# EAGLE design 2 Motors_V2 (EAGLE 9.6.2)
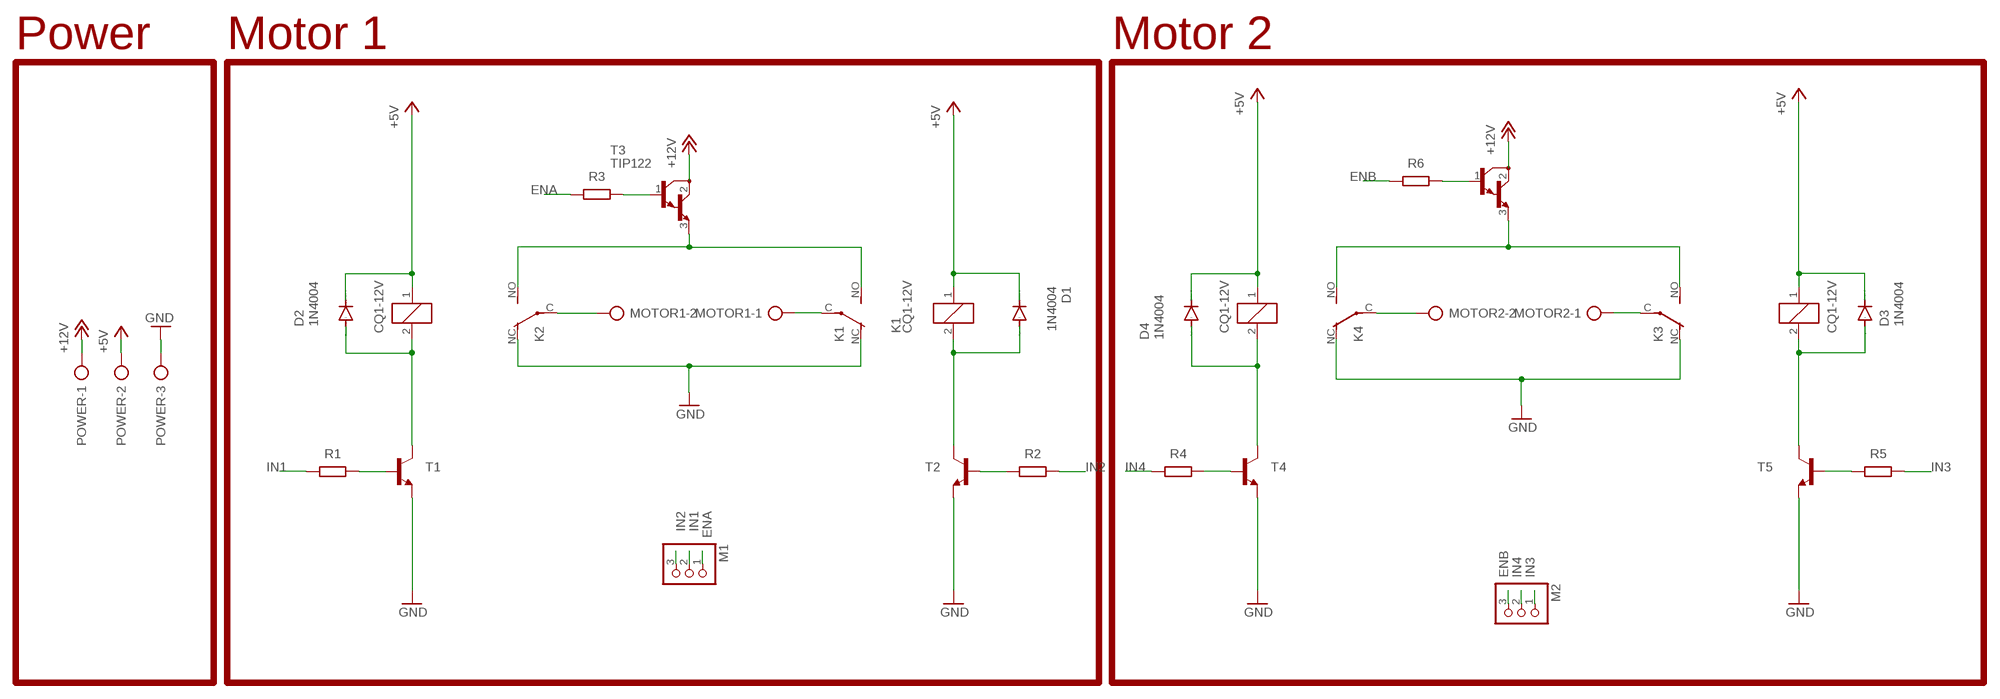
[diagram p0: schematic, sheet 1]

## Parts
D1  1N4004  [DO41-10]
D2  1N4004  [DO41-10]
D3  1N4004  [DO41-10]
D4  1N4004  [DO41-10]
K1  CQ1-12V  [CQ1]
K2  CQ1-12V  [CQ1]
K3  CQ1-12V  [CQ1]
K4  CQ1-12V  [CQ1]
M1  PINHD-1X3  [1X03]
M2  PINHD-1X3  [1X03]
MOTOR1  AK300/2  [AK300/2]
MOTOR2  AK300/2  [AK300/2]
POWER  AK300/3  [AK300/3]
R1  4.7k  R-EU_0204/7  [0204/7]
R2  4.7k  R-EU_0204/7  [0204/7]
R3  4.7k  R-EU_0204/7  [0204/7]
R4  4.7k  R-EU_0204/7  [0204/7]
R5  4.7k  R-EU_0204/7  [0204/7]
R6  4.7k  R-EU_0204/7  [0204/7]
T1  2N2222-NPN-TO92-EBC  [TO92-EBC]
T2  2N2222-NPN-TO92-EBC  [TO92-EBC]
T3  TIP122  [TO220]
T4  2N2222-NPN-TO92-EBC  [TO92-EBC]
T5  2N2222-NPN-TO92-EBC  [TO92-EBC]
T6  TIP122  [TO220]

## Nets
+5V: D1.C D2.C D3.C D4.C K1.1 K2.1 K3.1 K4.1 POWER.2
+12V: POWER.1 T3.2(C) T6.2(C)
ENA: M1.1 R3.2
ENB: M2.3 R6.2
GND: K1.NC(2:O) K2.NC(2:O) K3.NC(2:O) K4.NC(2:O) POWER.3 T1.E T2.E T4.E T5.E
IN1: M1.2 R1.1
IN2: M1.3 R2.1
IN3: M2.1 R5.1
IN4: M2.2 R4.2
N$1: K2.C(2:P) MOTOR1.2
N$2: K1.NO(2:S) K2.NO(2:S) T3.3(E)
N$3: D2.A K2.2 T1.C
N$5: K1.C(2:P) MOTOR1.1
N$6: D1.A K1.2 T2.C
N$7: D3.A K3.2 T5.C
N$8: K3.NO(2:S) K4.NO(2:S) T6.3(E)
N$9: D4.A K4.2 T4.C
N$14: K3.C(2:P) MOTOR2.1
N$16: K4.C(2:P) MOTOR2.2
T1: R1.2 T1.B
T2: R2.2 T2.B
T3: R3.1 T3.1(B)
T4: R4.1 T4.B
T5: R5.2 T5.B
T6: R6.1 T6.1(B)

## Notes on the sheet
- Power | Motor 1 | Motor 2

## Library data of the parts
D1-D4 = diode:1N4004: DIODE general purpose rectifier, 1 A
K1-K4 = relay:CQ1-12V: AUTOMOTIVE QUIET RELAY NAiS Source: http://www.mew-europe.com/.. en_ds_61208_0000.pdf; OC_FARNELL: unknown; OC_NEWARK: unknown
M1 M2 = pinhead:PINHD-1X3: PIN HEADER
MOTOR1 MOTOR2 = con-ptr500:AK300/2: CONNECTOR; OC_FARNELL: unknown; OC_NEWARK: unknown
POWER = con-ptr500:AK300/3: CONNECTOR; OC_FARNELL: unknown; OC_NEWARK: unknown
R1-R6 = rcl:R-EU_: RESISTOR, European symbol; SPICEPREFIX: R
T1 T2 T4 T5 = transistor-neu-to92:*-NPN-: NPN Transistror
T3 T6 = transistor:TIP122: NPN BIPOLAR DARLINGTON TRANSISTOR

## Board
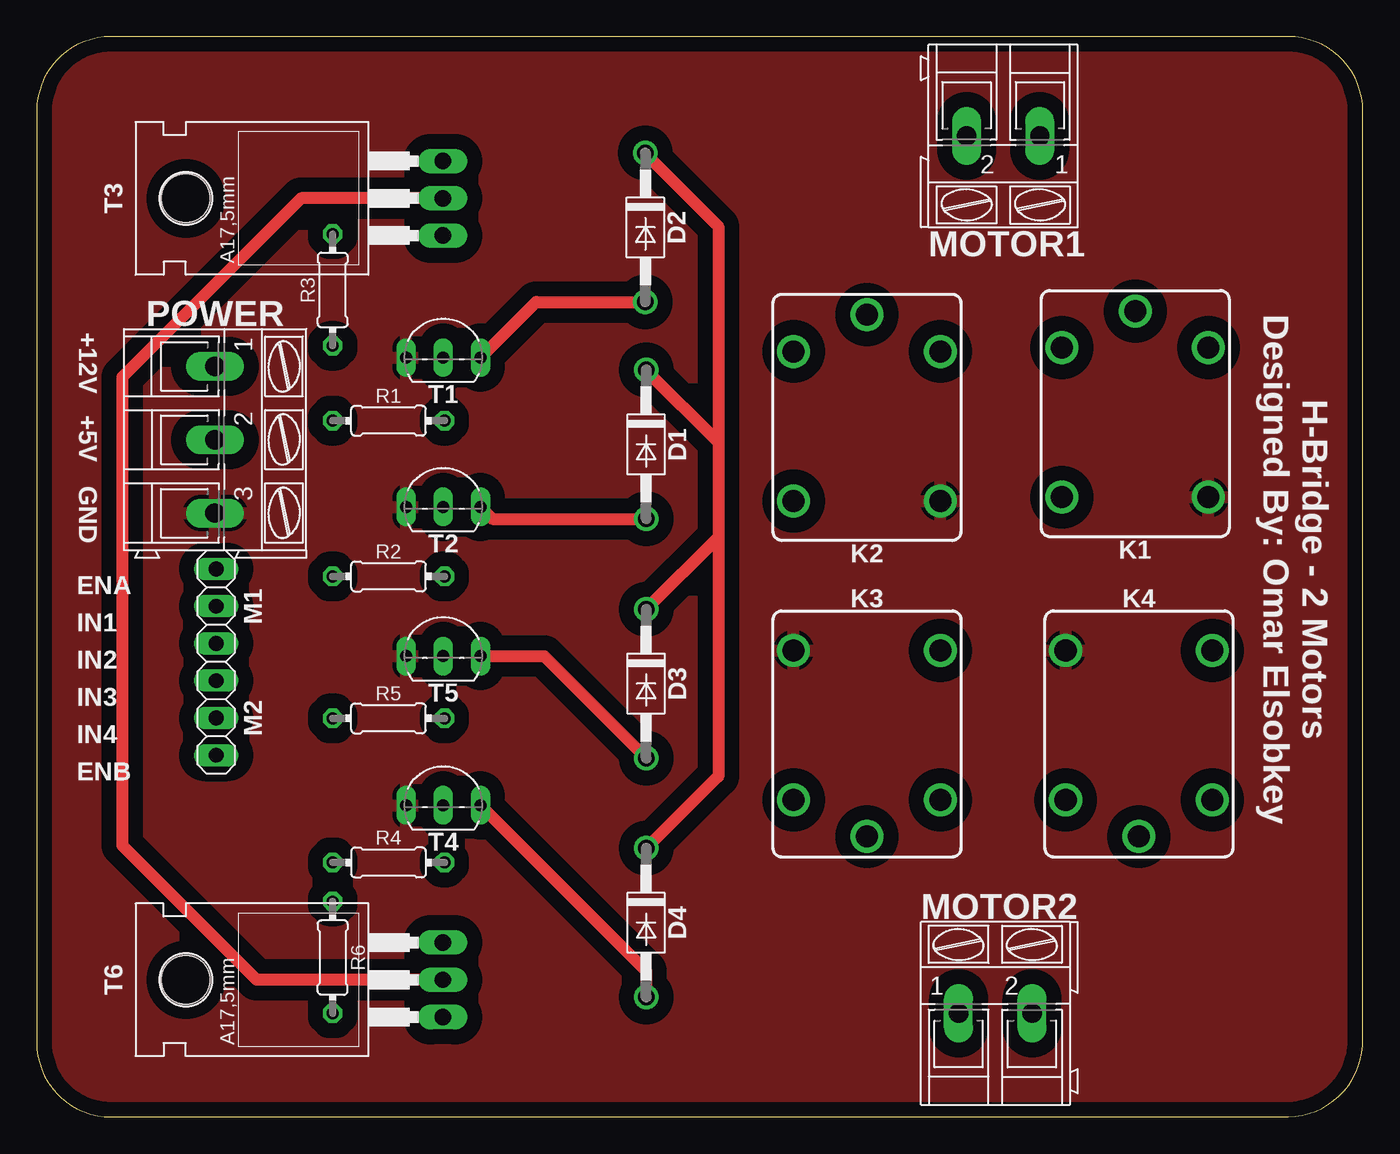
[diagram p1: board, top side]
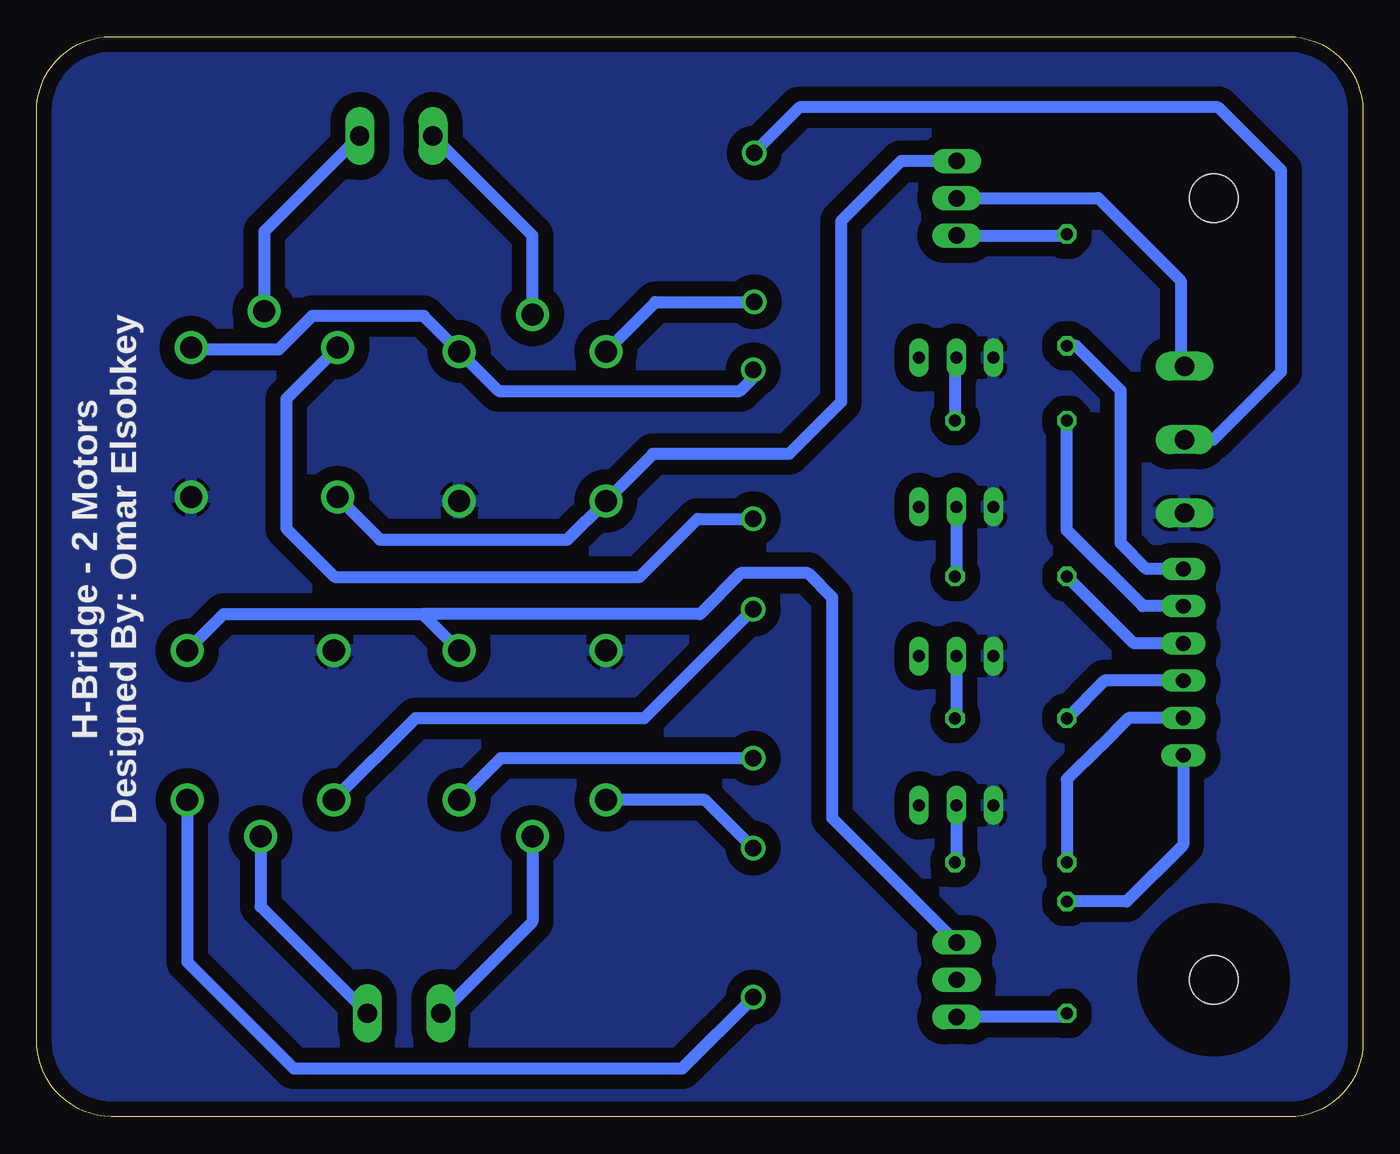
[diagram p2: board, bottom side, seen from below]

Size 90.42 x 73.66 mm. Coordinates in mm from the lower left corner, seen from the top.
Outline: 90.42,68.58 arc90 85.34,73.66 5.08,73.66 arc90 0,68.58 0,5.08 arc90 5.08,0 85.34,0 arc90 90.42,5.33 90.42,68.58
Copper layers (1*16): Top 0.035mm / dielectric 1.5mm / Bottom 0.035mm
Design rules "default *": minimum track width 32mil, minimum drill 0.35mm, track to track 16mil, track to pad 16mil, pad to pad 6mil, via to via 6mil, smd to smd 6mil, copper to edge 40mil, drill to drill 6mil, minimum pad ring 10mil, minimum via ring 8mil, stop-mask expansion 4mil, vias tented up to drill 0mil, thermal gap 10mil

### Footprints (pad centres in the part's own frame; a part is rotated, then mirrored left to right if it is on the bottom)
DO41-10 = drill 1.118: A 5.08,0; C -5.08,0
CQ1 = drill 1.5: 1 4.5,-5; 2 4.5,5; C 7,0; NC -5.7,-5; NO -5.7,5
1X03 = drill 1.016 long: 1 -2.54,0; 2 0,0; 3 2.54,0
AK300/2 = drill 1.321 long: 1 -2.515,0; 2 2.489,0
AK300/3 = drill 1.321 long: 1 -5.004,0; 2 0,0; 3 5.004,0
0204/7 = drill 0.813 octagon: 1 -3.81,0; 2 3.81,0
TO92-EBC = drill 0.813 long: B 0,-1.27; C 2.54,-1.27; E -2.54,-1.27
TO220 = drill 1.118 long: 1 -2.54,-6.35; 2 0,-6.35; 3 2.54,-6.35 | hole 3.302: 0,11.176

### Placement (x,y rotation side)
D1  41.55,45.86 270 top
D2  41.5,60.66 270 top
D3  41.55,29.55 270 top
D4  41.55,13.24 270 top
K1  74.9,47.96 90 top
K2  56.62,47.7 90 top
K3  56.62,26.11 270 top
K4  75.16,26.11 270 top
M1  12.24,34.82 270 top
M2  12.24,27.2 270 top
MOTOR1  65.89,66.88 180 top
MOTOR2  65.38,7.06 0 top
POWER  12.17,46.18 270 top
R1  23.99,47.47 0 top
R2  23.99,36.86 0 top
R3  20.18,56.39 270 top
R4  23.99,17.35 180 top
R5  23.99,27.18 0 top
R6  20.18,10.87 90 top
T1  27.72,53.05 0 top
T2  27.72,42.86 0 top
T3  21.35,62.64 90 top
T4  27.72,22.52 0 top
T5  27.72,32.69 0 top
T6  21.35,9.35 90 top

### Tracks (layer width: path | path; a pad name or v marks a point on that pad's centre or on a via)
+5V
  Top 0.813: D2.C 41.5,65.68 46.48,60.71 46.48,46.01 | 46.48,46.01 46.48,39.56 | 46.48,39.56 46.48,23.25 | 46.48,23.25 46.48,23.22 | D1.C 46.48,46.01 | D4.C 46.48,23.25 | D3.C 46.48,39.56
  Bottom 0.813: D1.C 41.55,50.43 42.48,49.5 58.92,49.5 K2.1 64.03,54.61 71.63,54.61 73.91,52.32 79.77,52.32 K1.1 | POWER.2 10.21,46.18 5.58,50.81 5.58,64.54 9.87,68.83 38.41,68.83 D2.C | D4.C 44.84,21.61 K3.1 | D3.C 49.01,27.18 64.59,27.18 K4.1
+12V
  Top 0.813: T3.2 18.02,62.64 5.84,50.46 5.84,18.5 15,9.35 T6.2
  Bottom 0.813: POWER.1 12.42,51.44 12.42,57.02 18.05,62.65 27.69,62.65 T3.2
ENA
  Bottom 0.813: M1.1 14.76,37.36 16.51,39.12 16.51,49.53 19.56,52.58 R3.2
ENB
  Bottom 0.813: M2.3 12.24,18.55 16.12,14.68 R6.2
GND
  pour Bottom (isolate 1.016): -2.26,74.96 92.25,74.96 92.25,-1.96 -2.26,-1.96
  pour Top (isolate 1.016): -3.53,76.99 94.28,76.99 94.28,-3.23 -3.53,-3.23
IN1
  Bottom 0.813: M1.2 15.01,34.82 20.18,39.99 R1.1
IN2
  Bottom 0.813: M1.3 15.61,32.28 R2.1
IN3
  Bottom 0.813: M2.1 17.61,29.74 R5.1
IN4
  Bottom 0.813: M2.2 15.98,27.2 17.91,25.27 20.18,23 R4.2
N$1
  Bottom 0.813: K2.C 56.62,60.1 MOTOR1.2
N$2
  Bottom 0.813: K1.NO 67.02,39.37 54.25,39.37 K2.NO 48.41,45.21 39.12,45.21 35.58,48.75 35.58,61.08 31.48,65.18 T3.3
N$3
  Top 0.813: T1.C 34.06,55.58 D2.A
  Bottom 0.813: K2.2 48.24,55.58 D2.A
N$5
  Bottom 0.813: MOTOR1.1 74.91,60.38 K1.C
N$6
  Top 0.813: T2.C 31.08,40.77 D1.A
  Bottom 0.813: K1.2 73.41,48.95 73.41,40.13 70.1,36.83 49.31,36.83 45.36,40.77 D1.A
N$7
  Top 0.813: T5.C 34.6,31.42 D3.A
  Bottom 0.813: K3.2 58.76,24.47 D3.A
N$8
  Bottom 0.813: K4.NO 77.68,34.29 64.09,34.29 | 64.09,34.29 K3.NO | 64.09,34.29 45.21,34.29 42.42,37.08 37.85,37.08 36.2,35.43 36.2,20.38 T6.3
N$9
  Top 0.813: T4.C 41.55,9.96 D4.A
  Bottom 0.813: K4.2 80.16,10.56 72.9,3.3 46.41,3.3 D4.A
N$14
  Bottom 0.813: K3.C 56.62,13.31 MOTOR2.1
N$16
  Bottom 0.813: K4.C 75.16,14.35 MOTOR2.2
T1
  Bottom 0.813: T1.B 27.8,51.7 R1.2
T2
  Bottom 0.813: T2.B 27.72,36.93 R2.2
T3
  Bottom 0.813: T3.1 20.19,60.1 R3.1
T4
  Bottom 0.813: T4.B 27.72,17.42 R4.1
T5
  Bottom 0.813: T5.B 27.72,27.25 R5.2
T6
  Bottom 0.813: R6.1 20.43,6.81 T6.1

### Text on the board
tNames: +12V | +5V | GND | H-Bridge - 2 Motors / Designed By: Omar Elsobkey | ENA | IN1 | IN2 | IN3 | IN4 | ENB
bNames: H-Bridge - 2 Motors / Designed By: Omar Elsobkey